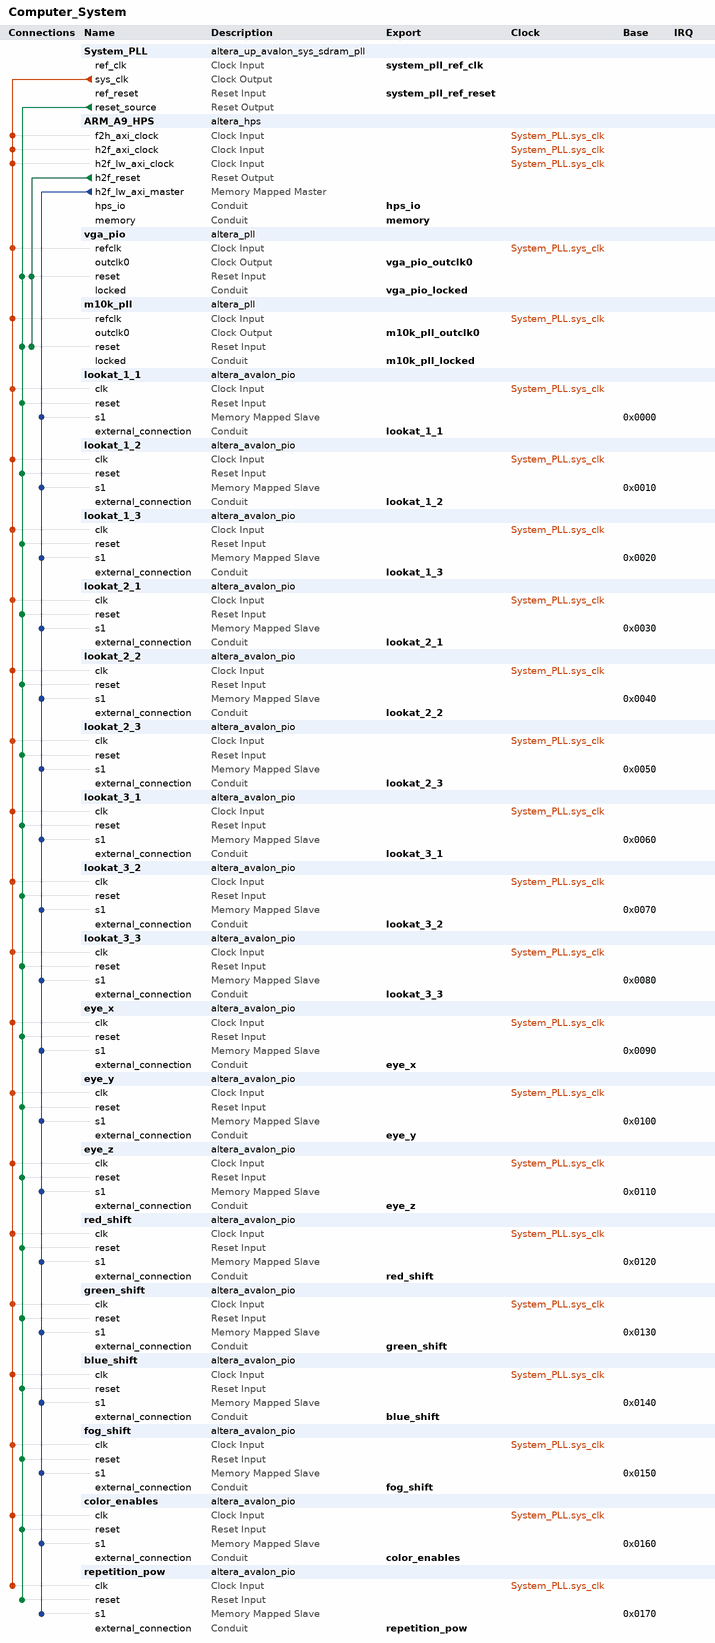
[diagram p0: system contents]
# Platform Designer (Qsys) system Computer_System, Cyclone V 5CSEMA5F31C6
# Parameters at their usual value, and those the tool derives, are not listed.
package require -exact qsys 23.1
create_system Computer_System
set_project_property DEVICE_FAMILY {Cyclone V}
set_project_property DEVICE 5CSEMA5F31C6

add_instance System_PLL altera_up_avalon_sys_sdram_pll 18.0
set_instance_parameter_value System_PLL CV_boards DE1-SoC
set_instance_parameter_value System_PLL gui_outclk 100.0
set_instance_parameter_value System_PLL gui_refclk 50.0

add_instance ARM_A9_HPS altera_hps 23.1
set_instance_parameter_value ARM_A9_HPS EMAC1_Mode RGMII
set_instance_parameter_value ARM_A9_HPS EMAC1_PinMuxing {HPS I/O Set 0}
set_instance_parameter_value ARM_A9_HPS F2SCLK_COLDRST_Enable false
set_instance_parameter_value ARM_A9_HPS F2SCLK_DBGRST_Enable false
set_instance_parameter_value ARM_A9_HPS F2SCLK_WARMRST_Enable false
set_instance_parameter_value ARM_A9_HPS F2SINTERRUPT_Enable true
set_instance_parameter_value ARM_A9_HPS F2S_Width 2
set_instance_parameter_value ARM_A9_HPS FPGA_PERIPHERAL_OUTPUT_CLOCK_FREQ_EMAC0_GTX_CLK 125
set_instance_parameter_value ARM_A9_HPS FPGA_PERIPHERAL_OUTPUT_CLOCK_FREQ_EMAC0_MD_CLK 100.0
set_instance_parameter_value ARM_A9_HPS FPGA_PERIPHERAL_OUTPUT_CLOCK_FREQ_EMAC1_GTX_CLK 125
set_instance_parameter_value ARM_A9_HPS FPGA_PERIPHERAL_OUTPUT_CLOCK_FREQ_EMAC1_MD_CLK 100.0
set_instance_parameter_value ARM_A9_HPS HPS_PROTOCOL DDR3
set_instance_parameter_value ARM_A9_HPS I2C0_Mode I2C
set_instance_parameter_value ARM_A9_HPS I2C0_PinMuxing {HPS I/O Set 0}
set_instance_parameter_value ARM_A9_HPS I2C1_Mode I2C
set_instance_parameter_value ARM_A9_HPS I2C1_PinMuxing {HPS I/O Set 0}
set_instance_parameter_value ARM_A9_HPS LWH2F_Enable true
set_instance_parameter_value ARM_A9_HPS MEM_BANKADDR_WIDTH 3
set_instance_parameter_value ARM_A9_HPS MEM_CLK_FREQ 400.0
set_instance_parameter_value ARM_A9_HPS MEM_COL_ADDR_WIDTH 10
set_instance_parameter_value ARM_A9_HPS MEM_DQ_WIDTH 32
set_instance_parameter_value ARM_A9_HPS MEM_DRV_STR RZQ/7
set_instance_parameter_value ARM_A9_HPS MEM_ROW_ADDR_WIDTH 15
set_instance_parameter_value ARM_A9_HPS MEM_RTT_NOM RZQ/4
set_instance_parameter_value ARM_A9_HPS MEM_RTT_WR RZQ/4
set_instance_parameter_value ARM_A9_HPS MEM_TCL 11
set_instance_parameter_value ARM_A9_HPS MEM_TFAW_NS 30.0
set_instance_parameter_value ARM_A9_HPS MEM_TRAS_NS 35.0
set_instance_parameter_value ARM_A9_HPS MEM_TRCD_NS 13.75
set_instance_parameter_value ARM_A9_HPS MEM_TRFC_NS 260.0
set_instance_parameter_value ARM_A9_HPS MEM_TRP_NS 13.75
set_instance_parameter_value ARM_A9_HPS MEM_VENDOR JEDEC
set_instance_parameter_value ARM_A9_HPS MEM_WTCL 8
set_instance_parameter_value ARM_A9_HPS QSPI_Mode {1 SS}
set_instance_parameter_value ARM_A9_HPS QSPI_PinMuxing {HPS I/O Set 0}
set_instance_parameter_value ARM_A9_HPS REF_CLK_FREQ 25.0
set_instance_parameter_value ARM_A9_HPS S2FCLK_USER2CLK 5
set_instance_parameter_value ARM_A9_HPS S2F_Width 3
set_instance_parameter_value ARM_A9_HPS SDIO_Mode {4-bit Data}
set_instance_parameter_value ARM_A9_HPS SDIO_PinMuxing {HPS I/O Set 0}
set_instance_parameter_value ARM_A9_HPS SPIM1_Mode {Single Slave Select}
set_instance_parameter_value ARM_A9_HPS SPIM1_PinMuxing {HPS I/O Set 0}
set_instance_parameter_value ARM_A9_HPS STM_Enable false
set_instance_parameter_value ARM_A9_HPS TIMING_BOARD_AC_SKEW 0.03
set_instance_parameter_value ARM_A9_HPS TIMING_BOARD_AC_TO_CK_SKEW 0.0
set_instance_parameter_value ARM_A9_HPS TIMING_BOARD_DQ_TO_DQS_SKEW 0.0
set_instance_parameter_value ARM_A9_HPS TIMING_BOARD_MAX_CK_DELAY 0.03
set_instance_parameter_value ARM_A9_HPS TIMING_BOARD_MAX_DQS_DELAY 0.02
set_instance_parameter_value ARM_A9_HPS TIMING_BOARD_SKEW_BETWEEN_DQS 0.08
set_instance_parameter_value ARM_A9_HPS TIMING_BOARD_SKEW_CKDQS_DIMM_MAX 0.16
set_instance_parameter_value ARM_A9_HPS TIMING_BOARD_SKEW_CKDQS_DIMM_MIN 0.09
set_instance_parameter_value ARM_A9_HPS TIMING_BOARD_SKEW_WITHIN_DQS 0.01
set_instance_parameter_value ARM_A9_HPS TIMING_TDH 65
set_instance_parameter_value ARM_A9_HPS TIMING_TDQSCK 255
set_instance_parameter_value ARM_A9_HPS TIMING_TDQSQ 125
set_instance_parameter_value ARM_A9_HPS TIMING_TDS 30
set_instance_parameter_value ARM_A9_HPS TIMING_TIH 140
set_instance_parameter_value ARM_A9_HPS TIMING_TIS 180
set_instance_parameter_value ARM_A9_HPS TIMING_TQSH 0.4
set_instance_parameter_value ARM_A9_HPS UART0_Mode {No Flow Control}
set_instance_parameter_value ARM_A9_HPS UART0_PinMuxing {HPS I/O Set 0}
set_instance_parameter_value ARM_A9_HPS USB1_Mode SDR
set_instance_parameter_value ARM_A9_HPS USB1_PinMuxing {HPS I/O Set 0}
set_instance_parameter_value ARM_A9_HPS desired_cfg_clk_mhz 100.0
set_instance_parameter_value ARM_A9_HPS desired_qspi_clk_mhz 400.0

add_instance vga_pio altera_pll 23.1
set_instance_parameter_value vga_pio gui_device_speed_grade 2
set_instance_parameter_value vga_pio gui_number_of_clocks 1
set_instance_parameter_value vga_pio gui_operation_mode direct
set_instance_parameter_value vga_pio gui_output_clock_frequency0 25.0
set_instance_parameter_value vga_pio gui_pll_mode {Integer-N PLL}
set_instance_parameter_value vga_pio gui_reference_clock_frequency 100.0
set_instance_parameter_value vga_pio gui_use_locked true

add_instance m10k_pll altera_pll 23.1
set_instance_parameter_value m10k_pll gui_device_speed_grade 2
set_instance_parameter_value m10k_pll gui_number_of_clocks 1
set_instance_parameter_value m10k_pll gui_operation_mode direct
set_instance_parameter_value m10k_pll gui_output_clock_frequency0 100.0
set_instance_parameter_value m10k_pll gui_pll_mode {Integer-N PLL}
set_instance_parameter_value m10k_pll gui_reference_clock_frequency 100.0
set_instance_parameter_value m10k_pll gui_use_locked true

add_instance lookat_1_1 altera_avalon_pio 23.1
set_instance_parameter_value lookat_1_1 direction Output
set_instance_parameter_value lookat_1_1 width 32

add_instance lookat_1_2 altera_avalon_pio 23.1
set_instance_parameter_value lookat_1_2 direction Output
set_instance_parameter_value lookat_1_2 width 32

add_instance lookat_1_3 altera_avalon_pio 23.1
set_instance_parameter_value lookat_1_3 direction Output
set_instance_parameter_value lookat_1_3 width 32

add_instance lookat_2_1 altera_avalon_pio 23.1
set_instance_parameter_value lookat_2_1 direction Output
set_instance_parameter_value lookat_2_1 width 32

add_instance lookat_2_2 altera_avalon_pio 23.1
set_instance_parameter_value lookat_2_2 direction Output
set_instance_parameter_value lookat_2_2 width 32

add_instance lookat_2_3 altera_avalon_pio 23.1
set_instance_parameter_value lookat_2_3 direction Output
set_instance_parameter_value lookat_2_3 width 32

add_instance lookat_3_1 altera_avalon_pio 23.1
set_instance_parameter_value lookat_3_1 direction Output
set_instance_parameter_value lookat_3_1 width 32

add_instance lookat_3_2 altera_avalon_pio 23.1
set_instance_parameter_value lookat_3_2 direction Output
set_instance_parameter_value lookat_3_2 width 32

add_instance lookat_3_3 altera_avalon_pio 23.1
set_instance_parameter_value lookat_3_3 direction Output
set_instance_parameter_value lookat_3_3 width 32

add_instance eye_x altera_avalon_pio 23.1
set_instance_parameter_value eye_x direction Output
set_instance_parameter_value eye_x width 32

add_instance eye_y altera_avalon_pio 23.1
set_instance_parameter_value eye_y direction Output
set_instance_parameter_value eye_y width 32

add_instance eye_z altera_avalon_pio 23.1
set_instance_parameter_value eye_z direction Output
set_instance_parameter_value eye_z width 32

add_instance red_shift altera_avalon_pio 23.1
set_instance_parameter_value red_shift direction Output
set_instance_parameter_value red_shift width 32

add_instance green_shift altera_avalon_pio 23.1
set_instance_parameter_value green_shift direction Output
set_instance_parameter_value green_shift width 32

add_instance blue_shift altera_avalon_pio 23.1
set_instance_parameter_value blue_shift direction Output
set_instance_parameter_value blue_shift width 32

add_instance fog_shift altera_avalon_pio 23.1
set_instance_parameter_value fog_shift direction Output
set_instance_parameter_value fog_shift width 32

add_instance color_enables altera_avalon_pio 23.1
set_instance_parameter_value color_enables direction Output
set_instance_parameter_value color_enables width 32

add_instance repetition_pow altera_avalon_pio 23.1
set_instance_parameter_value repetition_pow direction Output
set_instance_parameter_value repetition_pow width 32

# connections
add_connection System_PLL.sys_clk ARM_A9_HPS.f2h_axi_clock clock
add_connection System_PLL.sys_clk ARM_A9_HPS.h2f_axi_clock clock
add_connection System_PLL.sys_clk ARM_A9_HPS.h2f_lw_axi_clock clock
add_connection System_PLL.sys_clk blue_shift.clk clock
add_connection System_PLL.sys_clk color_enables.clk clock
add_connection System_PLL.sys_clk eye_x.clk clock
add_connection System_PLL.sys_clk eye_y.clk clock
add_connection System_PLL.sys_clk eye_z.clk clock
add_connection System_PLL.sys_clk fog_shift.clk clock
add_connection System_PLL.sys_clk green_shift.clk clock
add_connection System_PLL.sys_clk lookat_1_1.clk clock
add_connection System_PLL.sys_clk lookat_1_2.clk clock
add_connection System_PLL.sys_clk lookat_1_3.clk clock
add_connection System_PLL.sys_clk lookat_2_1.clk clock
add_connection System_PLL.sys_clk lookat_2_2.clk clock
add_connection System_PLL.sys_clk lookat_2_3.clk clock
add_connection System_PLL.sys_clk lookat_3_1.clk clock
add_connection System_PLL.sys_clk lookat_3_2.clk clock
add_connection System_PLL.sys_clk lookat_3_3.clk clock
add_connection System_PLL.sys_clk m10k_pll.refclk clock
add_connection System_PLL.sys_clk red_shift.clk clock
add_connection System_PLL.sys_clk repetition_pow.clk clock
add_connection System_PLL.sys_clk vga_pio.refclk clock
add_connection ARM_A9_HPS.h2f_reset m10k_pll.reset reset
add_connection ARM_A9_HPS.h2f_reset vga_pio.reset reset
add_connection System_PLL.reset_source blue_shift.reset reset
add_connection System_PLL.reset_source color_enables.reset reset
add_connection System_PLL.reset_source eye_x.reset reset
add_connection System_PLL.reset_source eye_y.reset reset
add_connection System_PLL.reset_source eye_z.reset reset
add_connection System_PLL.reset_source fog_shift.reset reset
add_connection System_PLL.reset_source green_shift.reset reset
add_connection System_PLL.reset_source lookat_1_1.reset reset
add_connection System_PLL.reset_source lookat_1_2.reset reset
add_connection System_PLL.reset_source lookat_1_3.reset reset
add_connection System_PLL.reset_source lookat_2_1.reset reset
add_connection System_PLL.reset_source lookat_2_2.reset reset
add_connection System_PLL.reset_source lookat_2_3.reset reset
add_connection System_PLL.reset_source lookat_3_1.reset reset
add_connection System_PLL.reset_source lookat_3_2.reset reset
add_connection System_PLL.reset_source lookat_3_3.reset reset
add_connection System_PLL.reset_source m10k_pll.reset reset
add_connection System_PLL.reset_source red_shift.reset reset
add_connection System_PLL.reset_source repetition_pow.reset reset
add_connection System_PLL.reset_source vga_pio.reset reset
add_connection ARM_A9_HPS.h2f_lw_axi_master blue_shift.s1 avalon
set_connection_parameter_value ARM_A9_HPS.h2f_lw_axi_master/blue_shift.s1 baseAddress 0x0140
add_connection ARM_A9_HPS.h2f_lw_axi_master color_enables.s1 avalon
set_connection_parameter_value ARM_A9_HPS.h2f_lw_axi_master/color_enables.s1 baseAddress 0x0160
add_connection ARM_A9_HPS.h2f_lw_axi_master eye_x.s1 avalon
set_connection_parameter_value ARM_A9_HPS.h2f_lw_axi_master/eye_x.s1 baseAddress 0x0090
add_connection ARM_A9_HPS.h2f_lw_axi_master eye_y.s1 avalon
set_connection_parameter_value ARM_A9_HPS.h2f_lw_axi_master/eye_y.s1 baseAddress 0x0100
add_connection ARM_A9_HPS.h2f_lw_axi_master eye_z.s1 avalon
set_connection_parameter_value ARM_A9_HPS.h2f_lw_axi_master/eye_z.s1 baseAddress 0x0110
add_connection ARM_A9_HPS.h2f_lw_axi_master fog_shift.s1 avalon
set_connection_parameter_value ARM_A9_HPS.h2f_lw_axi_master/fog_shift.s1 baseAddress 0x0150
add_connection ARM_A9_HPS.h2f_lw_axi_master green_shift.s1 avalon
set_connection_parameter_value ARM_A9_HPS.h2f_lw_axi_master/green_shift.s1 baseAddress 0x0130
add_connection ARM_A9_HPS.h2f_lw_axi_master lookat_1_1.s1 avalon
set_connection_parameter_value ARM_A9_HPS.h2f_lw_axi_master/lookat_1_1.s1 baseAddress 0x0000
add_connection ARM_A9_HPS.h2f_lw_axi_master lookat_1_2.s1 avalon
set_connection_parameter_value ARM_A9_HPS.h2f_lw_axi_master/lookat_1_2.s1 baseAddress 0x0010
add_connection ARM_A9_HPS.h2f_lw_axi_master lookat_1_3.s1 avalon
set_connection_parameter_value ARM_A9_HPS.h2f_lw_axi_master/lookat_1_3.s1 baseAddress 0x0020
add_connection ARM_A9_HPS.h2f_lw_axi_master lookat_2_1.s1 avalon
set_connection_parameter_value ARM_A9_HPS.h2f_lw_axi_master/lookat_2_1.s1 baseAddress 0x0030
add_connection ARM_A9_HPS.h2f_lw_axi_master lookat_2_2.s1 avalon
set_connection_parameter_value ARM_A9_HPS.h2f_lw_axi_master/lookat_2_2.s1 baseAddress 0x0040
add_connection ARM_A9_HPS.h2f_lw_axi_master lookat_2_3.s1 avalon
set_connection_parameter_value ARM_A9_HPS.h2f_lw_axi_master/lookat_2_3.s1 baseAddress 0x0050
add_connection ARM_A9_HPS.h2f_lw_axi_master lookat_3_1.s1 avalon
set_connection_parameter_value ARM_A9_HPS.h2f_lw_axi_master/lookat_3_1.s1 baseAddress 0x0060
add_connection ARM_A9_HPS.h2f_lw_axi_master lookat_3_2.s1 avalon
set_connection_parameter_value ARM_A9_HPS.h2f_lw_axi_master/lookat_3_2.s1 baseAddress 0x0070
add_connection ARM_A9_HPS.h2f_lw_axi_master lookat_3_3.s1 avalon
set_connection_parameter_value ARM_A9_HPS.h2f_lw_axi_master/lookat_3_3.s1 baseAddress 0x0080
add_connection ARM_A9_HPS.h2f_lw_axi_master red_shift.s1 avalon
set_connection_parameter_value ARM_A9_HPS.h2f_lw_axi_master/red_shift.s1 baseAddress 0x0120
add_connection ARM_A9_HPS.h2f_lw_axi_master repetition_pow.s1 avalon
set_connection_parameter_value ARM_A9_HPS.h2f_lw_axi_master/repetition_pow.s1 baseAddress 0x0170

# exported interfaces
add_interface blue_shift conduit end
set_interface_property blue_shift EXPORT_OF blue_shift.external_connection
add_interface color_enables conduit end
set_interface_property color_enables EXPORT_OF color_enables.external_connection
add_interface eye_x conduit end
set_interface_property eye_x EXPORT_OF eye_x.external_connection
add_interface eye_y conduit end
set_interface_property eye_y EXPORT_OF eye_y.external_connection
add_interface eye_z conduit end
set_interface_property eye_z EXPORT_OF eye_z.external_connection
add_interface fog_shift conduit end
set_interface_property fog_shift EXPORT_OF fog_shift.external_connection
add_interface green_shift conduit end
set_interface_property green_shift EXPORT_OF green_shift.external_connection
add_interface hps_io conduit end
set_interface_property hps_io EXPORT_OF ARM_A9_HPS.hps_io
add_interface lookat_1_1 conduit end
set_interface_property lookat_1_1 EXPORT_OF lookat_1_1.external_connection
add_interface lookat_1_2 conduit end
set_interface_property lookat_1_2 EXPORT_OF lookat_1_2.external_connection
add_interface lookat_1_3 conduit end
set_interface_property lookat_1_3 EXPORT_OF lookat_1_3.external_connection
add_interface lookat_2_1 conduit end
set_interface_property lookat_2_1 EXPORT_OF lookat_2_1.external_connection
add_interface lookat_2_2 conduit end
set_interface_property lookat_2_2 EXPORT_OF lookat_2_2.external_connection
add_interface lookat_2_3 conduit end
set_interface_property lookat_2_3 EXPORT_OF lookat_2_3.external_connection
add_interface lookat_3_1 conduit end
set_interface_property lookat_3_1 EXPORT_OF lookat_3_1.external_connection
add_interface lookat_3_2 conduit end
set_interface_property lookat_3_2 EXPORT_OF lookat_3_2.external_connection
add_interface lookat_3_3 conduit end
set_interface_property lookat_3_3 EXPORT_OF lookat_3_3.external_connection
add_interface m10k_pll_locked conduit end
set_interface_property m10k_pll_locked EXPORT_OF m10k_pll.locked
add_interface m10k_pll_outclk0 clock source
set_interface_property m10k_pll_outclk0 EXPORT_OF m10k_pll.outclk0
add_interface memory conduit end
set_interface_property memory EXPORT_OF ARM_A9_HPS.memory
add_interface red_shift conduit end
set_interface_property red_shift EXPORT_OF red_shift.external_connection
add_interface repetition_pow conduit end
set_interface_property repetition_pow EXPORT_OF repetition_pow.external_connection
add_interface system_pll_ref_clk clock sink
set_interface_property system_pll_ref_clk EXPORT_OF System_PLL.ref_clk
add_interface system_pll_ref_reset reset sink
set_interface_property system_pll_ref_reset EXPORT_OF System_PLL.ref_reset
add_interface vga_pio_locked conduit end
set_interface_property vga_pio_locked EXPORT_OF vga_pio.locked
add_interface vga_pio_outclk0 clock source
set_interface_property vga_pio_outclk0 EXPORT_OF vga_pio.outclk0

set_interconnect_requirement {$system} qsys_mm.clockCrossingAdapter HANDSHAKE
set_interconnect_requirement {$system} qsys_mm.enableEccProtection FALSE
set_interconnect_requirement {$system} qsys_mm.insertDefaultSlave FALSE
set_interconnect_requirement {$system} qsys_mm.maxAdditionalLatency 1

save_system Computer_System.qsys
